# Altium schematic sheet ArtixPower.SchDoc
size A
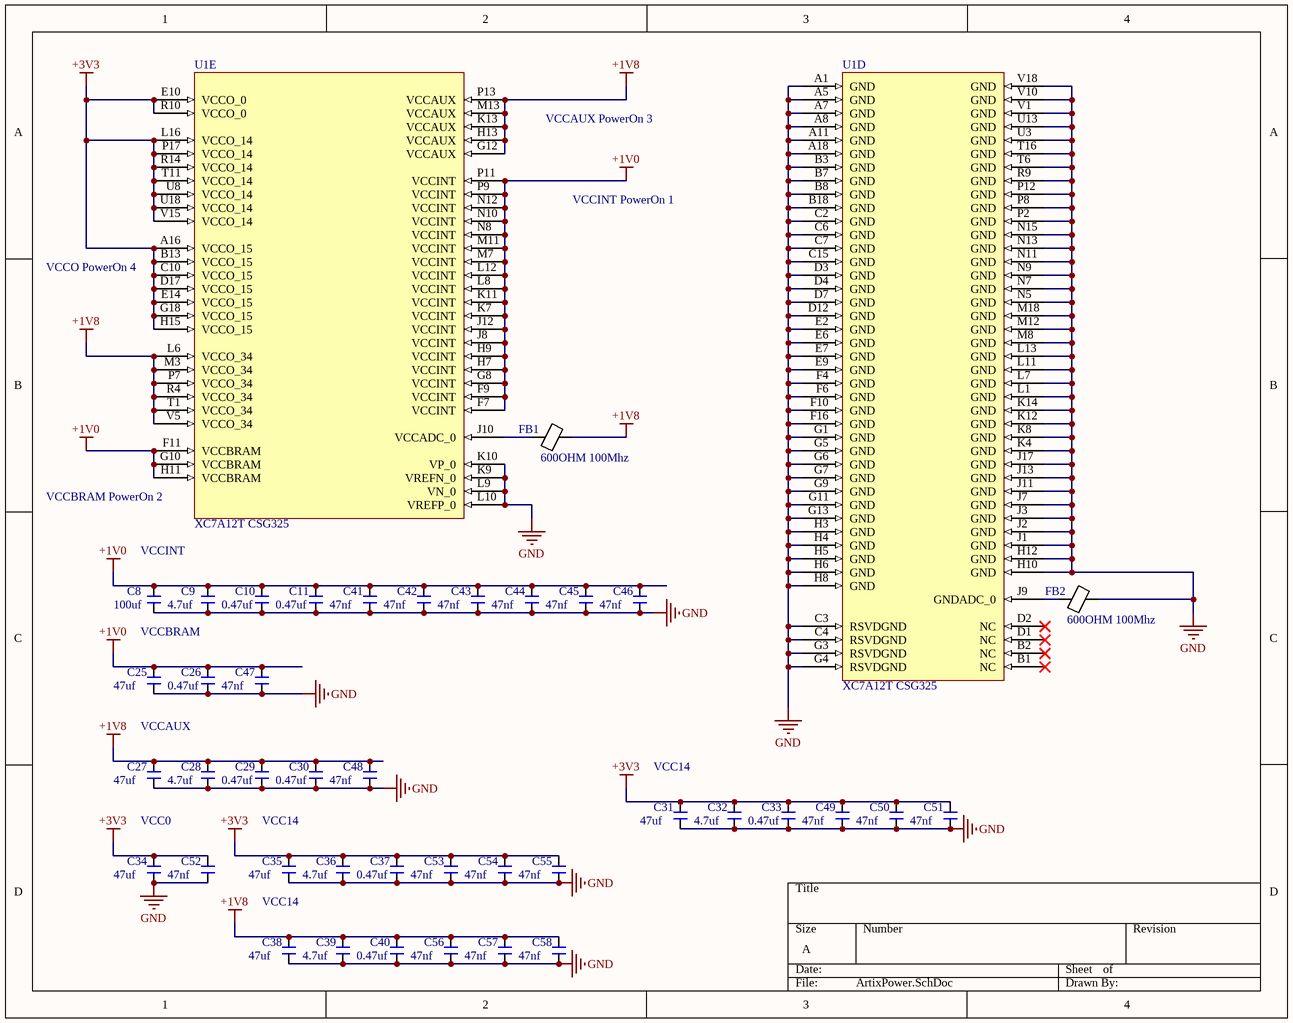
[diagram p0: ArtixPower.SchDoc]

## Parts
C8  100uf  [1206]
C9  4.7uf  [0402Footprint]
C10  0.47uf  [0402Footprint]
C11  0.47uf  [0402Footprint]
C25  47uf  [0805FOOTPRINT]
C26  0.47uf  [0402Footprint]
C27  47uf  [0805FOOTPRINT]
C28  4.7uf  [0402Footprint]
C29  0.47uf  [0402Footprint]
C30  0.47uf  [0402Footprint]
C31  47uf  [0805FOOTPRINT]
C32  4.7uf  [0402Footprint]
C33  0.47uf  [0402Footprint]
C34  47uf  [0805FOOTPRINT]
C35  47uf  [0805FOOTPRINT]
C36  4.7uf  [0402Footprint]
C37  0.47uf  [0402Footprint]
C38  47uf  [0805FOOTPRINT]
C39  4.7uf  [0402Footprint]
C40  0.47uf  [0402Footprint]
C41  47nf  [0402Footprint]
C42  47nf  [0402Footprint]
C43  47nf  [0402Footprint]
C44  47nf  [0402Footprint]
C45  47nf  [0402Footprint]
C46  47nf  [0402Footprint]
C47  47nf  [0402Footprint]
C48  47nf  [0402Footprint]
C49  47nf  [0402Footprint]
C50  47nf  [0402Footprint]
C51  47nf  [0402Footprint]
C52  47nf  [0402Footprint]
C53  47nf  [0402Footprint]
C54  47nf  [0402Footprint]
C55  47nf  [0402Footprint]
C56  47nf  [0402Footprint]
C57  47nf  [0402Footprint]
C58  47nf  [0402Footprint]
FB1  600OHM 100Mhz  [0805]
FB2  600OHM 100Mhz  [0805]
U1  XC7A12T CSG325  [BGA324C80P18X18_1500X1500X150]  (parts D,E of 7)

## Nets
+1V0: C8.1 C9.1 C10.1 C11.1 C25.1 C26.1 C41.1 C42.1 C43.1 C44.1 C45.1 C46.1 C47.1 U1.F7(VCCINT) U1.F9(VCCINT) U1.F11(VCCBRAM) U1.G8(VCCINT) U1.G10(VCCBRAM) U1.H7(VCCINT) U1.H9(VCCINT) U1.H11(VCCBRAM) U1.J8(VCCINT) U1.J12(VCCINT) U1.K7(VCCINT) U1.K11(VCCINT) U1.L8(VCCINT) U1.L12(VCCINT) U1.M7(VCCINT) U1.M11(VCCINT) U1.N8(VCCINT) U1.N10(VCCINT) U1.N12(VCCINT) U1.P9(VCCINT) U1.P11(VCCINT)
+1V8: C27.1 C28.1 C29.1 C30.1 C38.1 C39.1 C40.1 C48.1 C56.1 C57.1 C58.1 FB1.2 U1.G12(VCCAUX) U1.H13(VCCAUX) U1.K13(VCCAUX) U1.L6(VCCO_34) U1.M3(VCCO_34) U1.M13(VCCAUX) U1.P7(VCCO_34) U1.P13(VCCAUX) U1.R4(VCCO_34) U1.T1(VCCO_34) U1.V5(VCCO_34)
+3V3: C31.1 C32.1 C33.1 C34.1 C35.1 C36.1 C37.1 C49.1 C50.1 C51.1 C52.1 C53.1 C54.1 C55.1 U1.A16(VCCO_15) U1.B13(VCCO_15) U1.C10(VCCO_15) U1.D17(VCCO_15) U1.E10(VCCO_0) U1.E14(VCCO_15) U1.G18(VCCO_15) U1.H15(VCCO_15) U1.L16(VCCO_14) U1.P17(VCCO_14) U1.R10(VCCO_0) U1.R14(VCCO_14) U1.T11(VCCO_14) U1.U8(VCCO_14) U1.U18(VCCO_14) U1.V15(VCCO_14)
GND: C8.2 C9.2 C10.2 C11.2 C25.2 C26.2 C27.2 C28.2 C29.2 C30.2 C31.2 C32.2 C33.2 C34.2 C35.2 C36.2 C37.2 C38.2 C39.2 C40.2 C41.2 C42.2 C43.2 C44.2 C45.2 C46.2 C47.2 C48.2 C49.2 C50.2 C51.2 C52.2 C53.2 C54.2 C55.2 C56.2 C57.2 C58.2 FB2.2 U1.A1(GND) U1.A5(GND) U1.A7(GND) U1.A8(GND) U1.A11(GND) U1.A18(GND) U1.B3(GND) U1.B7(GND) U1.B8(GND) U1.B18(GND) U1.C2(GND) U1.C3(RSVDGND) U1.C4(RSVDGND) U1.C6(GND) U1.C7(GND) U1.C15(GND) U1.D3(GND) U1.D4(GND) U1.D7(GND) U1.D12(GND) U1.E2(GND) U1.E6(GND) U1.E7(GND) U1.E9(GND) U1.F4(GND) U1.F6(GND) U1.F10(GND) U1.F16(GND) U1.G1(GND) U1.G3(RSVDGND) U1.G4(RSVDGND) U1.G5(GND) U1.G6(GND) U1.G7(GND) U1.G9(GND) U1.G11(GND) U1.G13(GND) U1.H3(GND) U1.H4(GND) U1.H5(GND) U1.H6(GND) U1.H8(GND) U1.H10(GND) U1.H12(GND) U1.J1(GND) U1.J2(GND) U1.J3(GND) U1.J7(GND) U1.J11(GND) U1.J13(GND) U1.J17(GND) U1.K4(GND) U1.K8(GND) U1.K9(VREFN_0) U1.K10(VP_0) U1.K12(GND) U1.K14(GND) U1.L1(GND) U1.L7(GND) U1.L9(VN_0) U1.L10(VREFP_0) U1.L11(GND) U1.L13(GND) U1.M8(GND) U1.M12(GND) U1.M18(GND) U1.N5(GND) U1.N7(GND) U1.N9(GND) U1.N11(GND) U1.N13(GND) U1.N15(GND) U1.P2(GND) U1.P8(GND) U1.P12(GND) U1.R9(GND) U1.T6(GND) U1.T16(GND) U1.U3(GND) U1.U13(GND) U1.V1(GND) U1.V10(GND) U1.V18(GND)
NetFB1_1: FB1.1 U1.J10(VCCADC_0)
NetFB2_1: FB2.1 U1.J9(GNDADC_0)

Not connected (* = marked no-connect by the designer): U1 B1(NC)* B2(NC)* D1(NC)* D2(NC)*

## Notes on the sheet
- VCCAUX PowerOn 3
- VCCINT PowerOn 1
- VCCO PowerOn 4
- (near U1) VCCBRAM PowerOn 2
- VCCINT
- VCCBRAM
- VCCAUX
- (near C31) VCC14
- VCC0
- VCC14

## Library data of the parts
C8 = 100uf_1206: 1206; Manufacturer 1: *; Manufacturer Part Number 1: *
C9 C28 C32 C36 C39 = 4.7uf_0402: 0402; Manufacturer 1: *; Manufacturer Part Number 1: *
C10 C11 C26 C29 C30 C33 C37 C40 = 0.47uf_0402: 0402; Manufacturer 1: *; Manufacturer Part Number 1: *
C25 C27 C31 C34 C35 C38 = 47uf_0805: 0805; Manufacturer 1: *; Manufacturer Part Number 1: *
C41-C58 = 47nf_0402: 0402; Manufacturer 1: *; Manufacturer Part Number 1: *
FB1 FB2 = HZ0805E601R-10: FERRITE BEAD 600 OHM 0805; Manufacturer 1: Laird-Signal Integrity; Manufacturer Part Number 1: HZ0805E601R-10
U1 = XC7A12T_1CSG325I